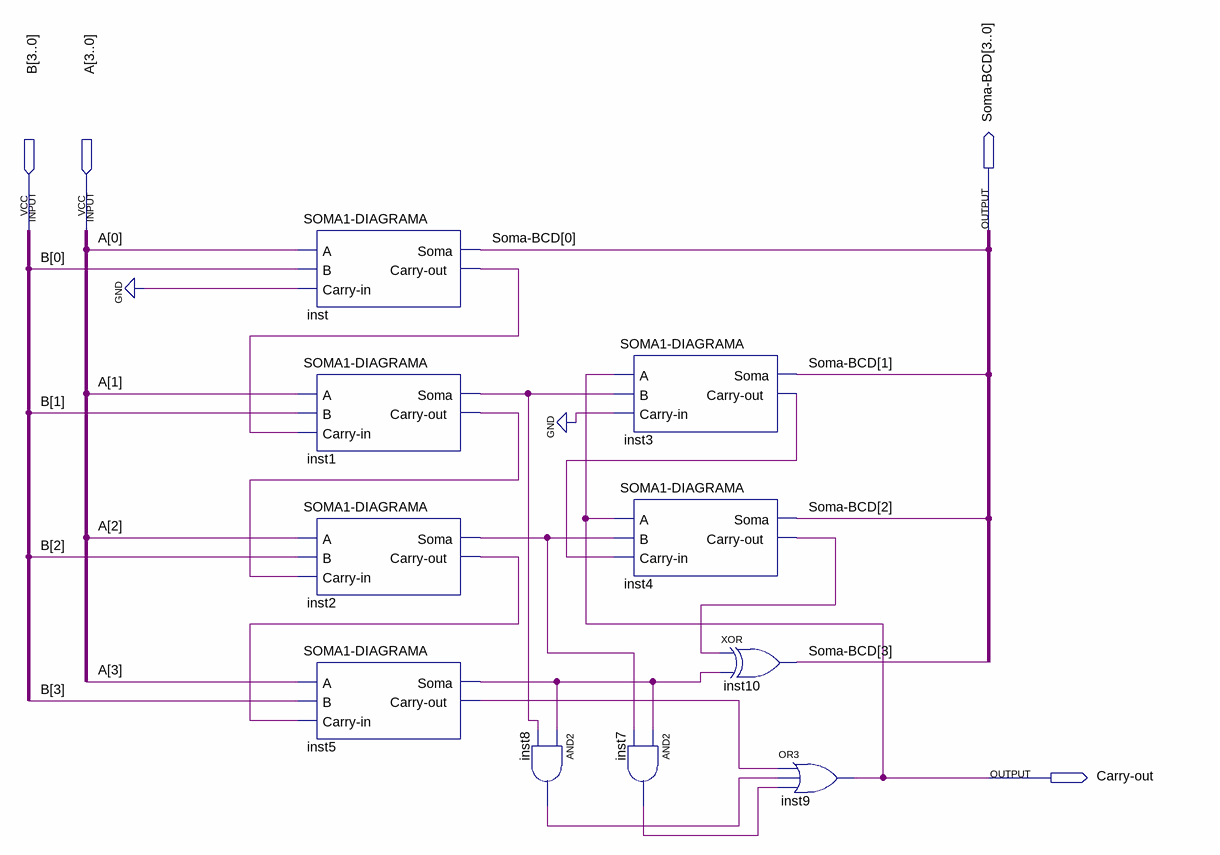
[diagram p0: schematic sheet]
// Quartus schematic BCD-DIAGRAMA.bdf as structural Verilog: 10 symbols, 4 pins
module \BCD-DIAGRAMA  (
  input  [3:0] B,
  input  [3:0] A,
  output [3:0] \Soma-BCD ,
  output \Carry-out 
);

  wire inst1_carry_out, inst1_soma, inst2_carry_out, inst2_soma, inst3_carry_out, inst4_carry_out,
       inst5_carry_out, inst5_soma, inst7_out, inst8_out, inst_carry_out;

  \SOMA1-DIAGRAMA  inst (.A(A[0]), .B(B[0]), .\Carry-in (1'b0), .Soma(\Soma-BCD [0]), .\Carry-out (inst_carry_out));
  \SOMA1-DIAGRAMA  inst1 (
    .A(A[1]), .B(B[1]), .\Carry-in (inst_carry_out), .Soma(inst1_soma), .\Carry-out (inst1_carry_out));
  \SOMA1-DIAGRAMA  inst2 (
    .A(A[2]), .B(B[2]), .\Carry-in (inst1_carry_out), .Soma(inst2_soma), .\Carry-out (inst2_carry_out));
  \SOMA1-DIAGRAMA  inst5 (
    .A(A[3]), .B(B[3]), .\Carry-in (inst2_carry_out), .Soma(inst5_soma), .\Carry-out (inst5_carry_out));
  and inst8 (inst8_out, inst5_soma, inst1_soma);
  \SOMA1-DIAGRAMA  inst3 (
    .A(\Carry-out ), .B(inst1_soma), .\Carry-in (1'b0), .Soma(\Soma-BCD [1]), .\Carry-out (inst3_carry_out));
  \SOMA1-DIAGRAMA  inst4 (
    .A(\Carry-out ), .B(inst2_soma), .\Carry-in (inst3_carry_out), .Soma(\Soma-BCD [2]),
    .\Carry-out (inst4_carry_out));
  and inst7 (inst7_out, inst5_soma, inst2_soma);
  xor inst10 (\Soma-BCD [3], inst4_carry_out, inst5_soma);
  or inst9 (\Carry-out , inst5_carry_out, inst8_out, inst7_out);
endmodule
